# EAGLE design SolderDispenser v1.1 (EAGLE 9.6.2)
CNAME: Solder paste dispenser; DESIGNER: Miroslav Pivovarsky
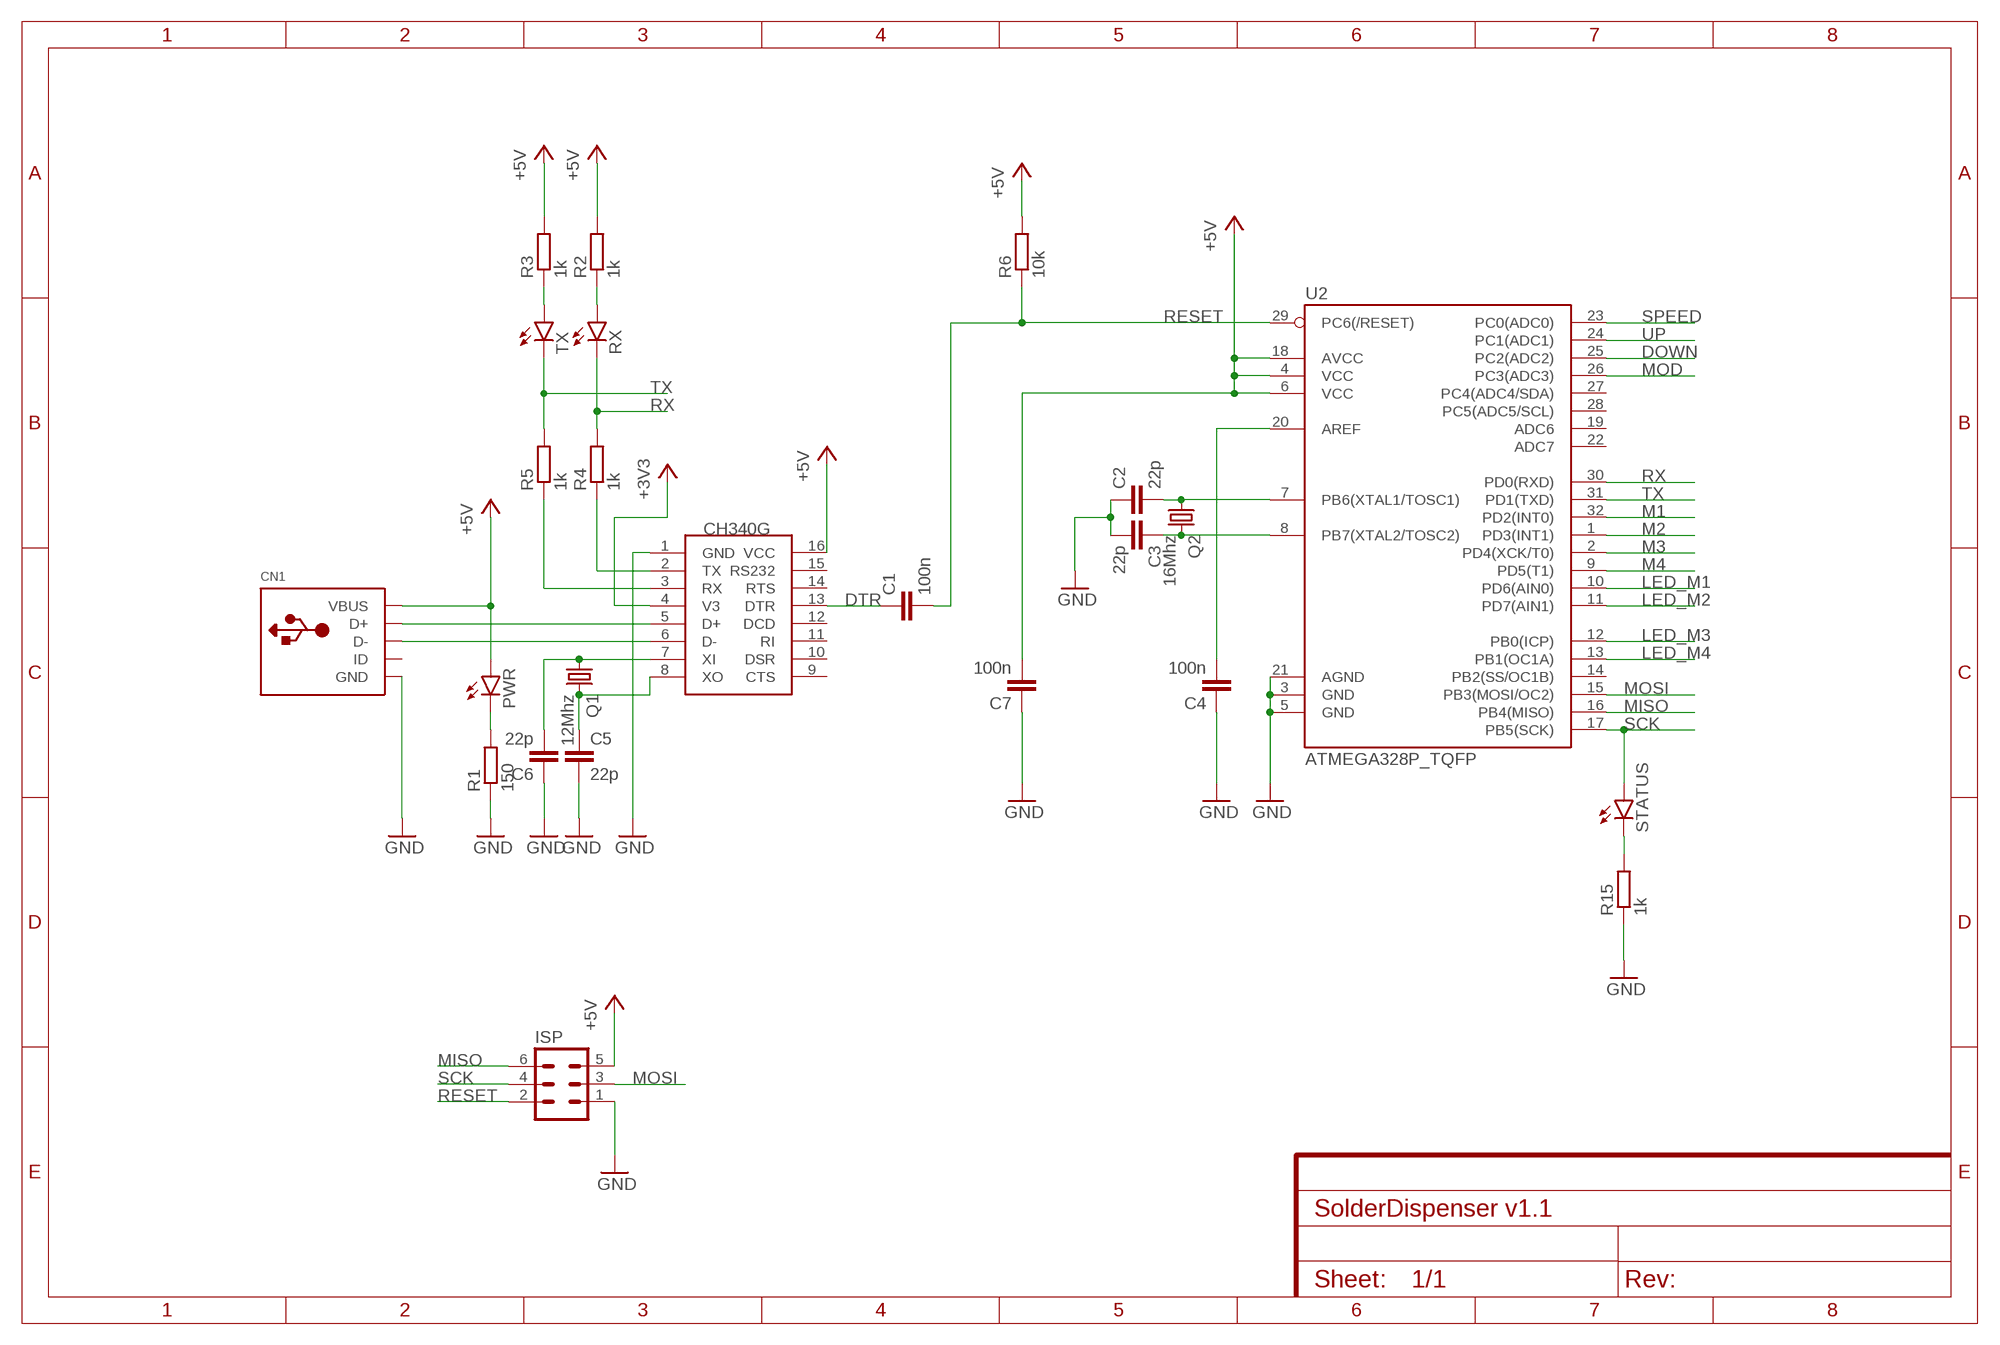
[diagram p0: schematic, sheet 1, part 1 of 2]
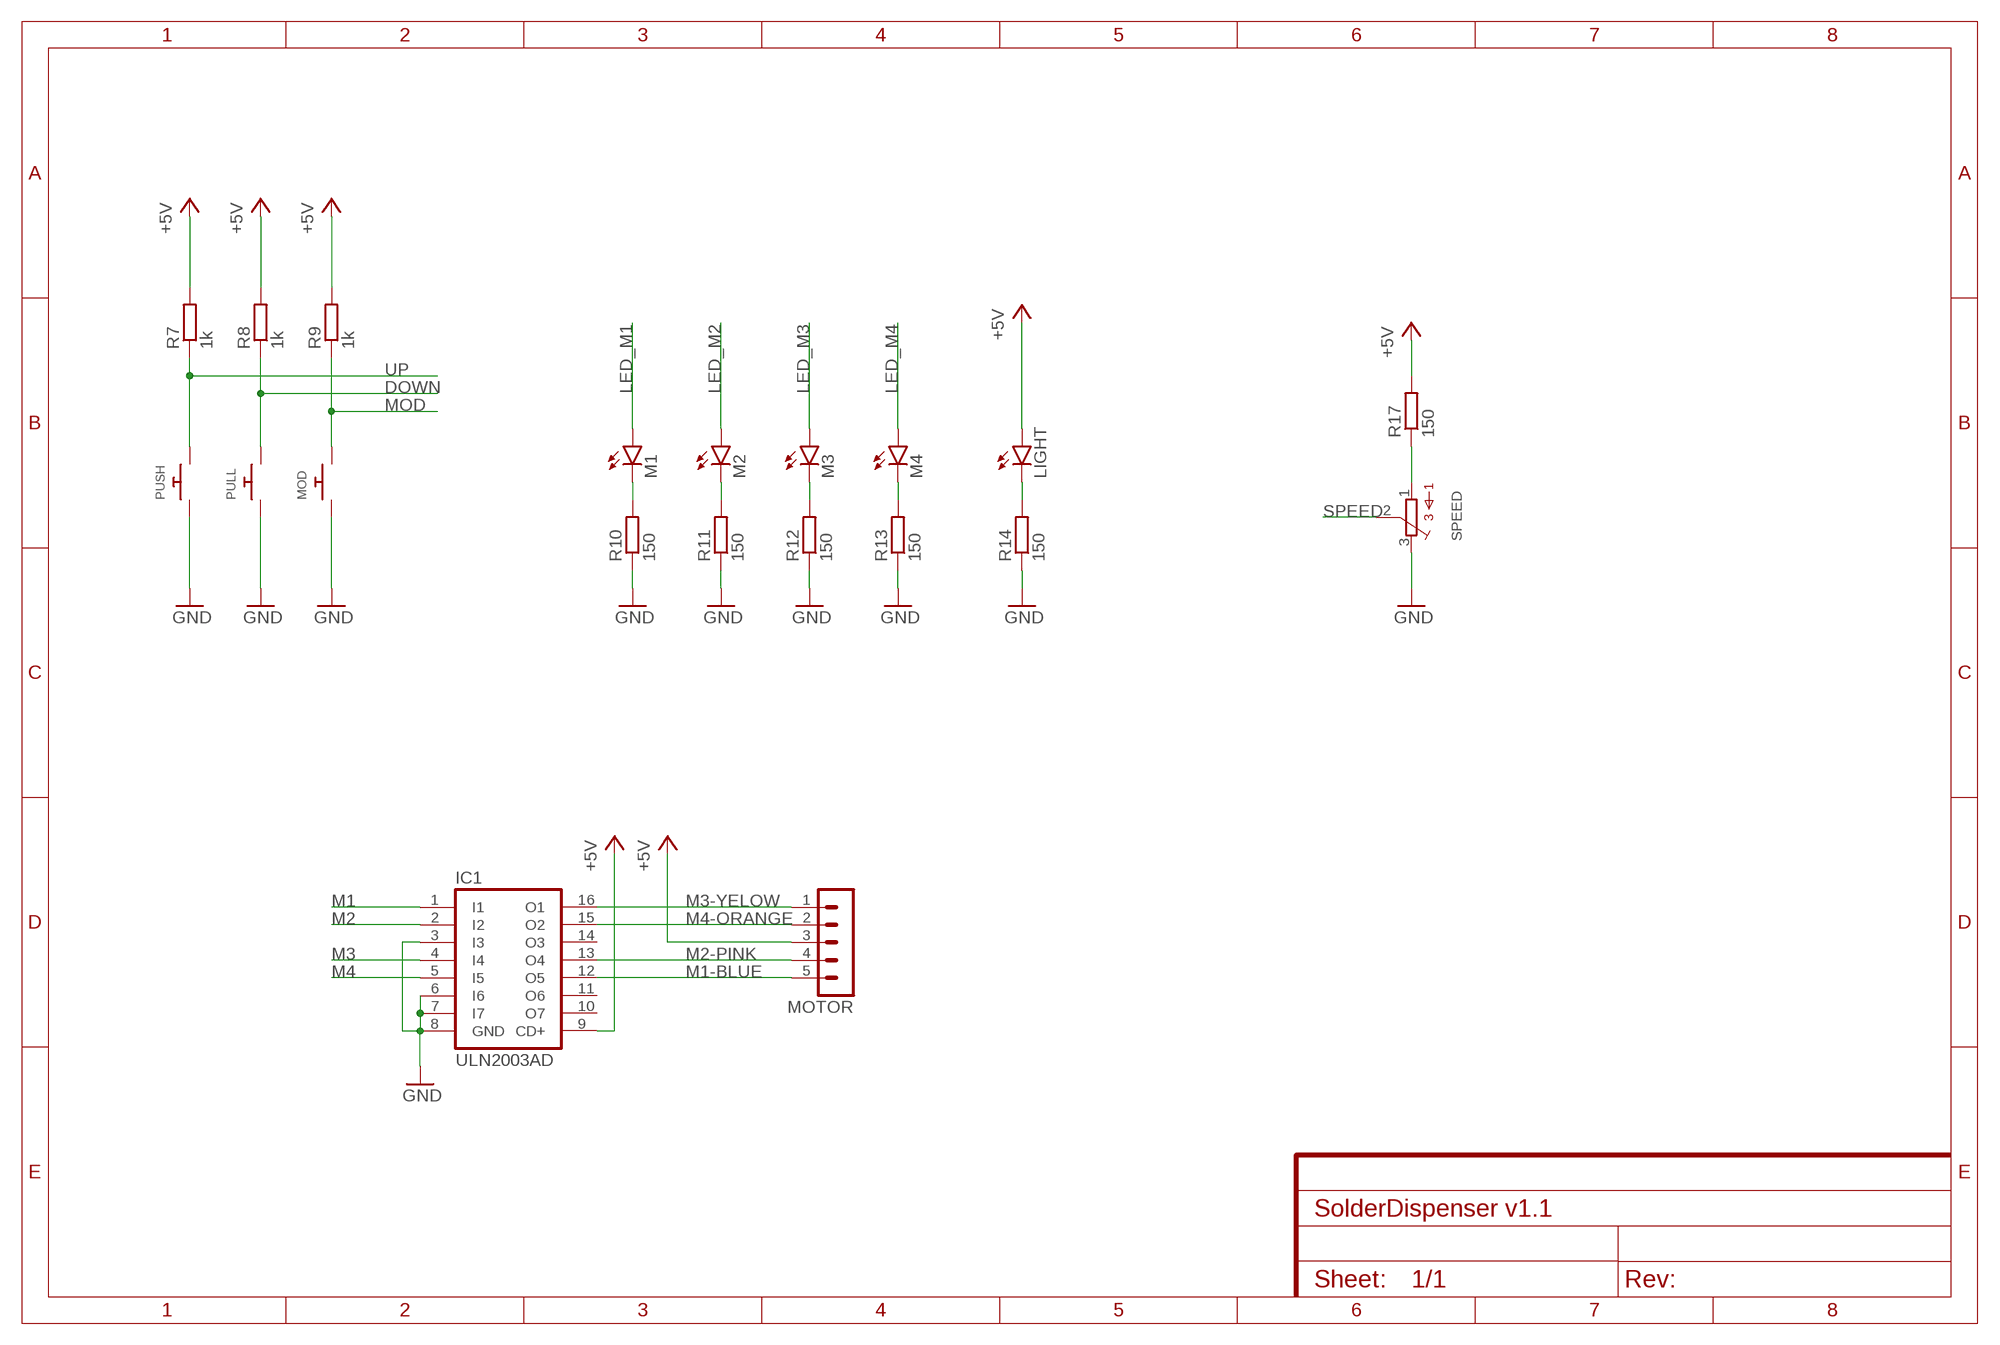
[diagram p1: schematic, sheet 1, part 2 of 2]

## Parts
C1  100n  C-EUC0805  [C0805]
C2  22p  C-EUC0805  [C0805]
C3  22p  C-EUC0805  [C0805]
C4  100n  C-EUC0805  [C0805]
C5  22p  C-EUC0805  [C0805]
C6  22p  C-EUC0805  [C0805]
C7  100n  C-EUC0805  [C0805]
CN1  USBMOLEX  [USB-MINIB-THM-MOLEX]
IC1  ULN2003AD  [SO16]
ISP  MA03-2  [MA03-2]
LIGHT  LED5MM  [LED5MM]
M1  LEDSML0805  [SML0805]
M2  LEDSML0805  [SML0805]
M3  LEDSML0805  [SML0805]
M4  LEDSML0805  [SML0805]
MOD  SWITCH_PUSHBUTTONEVQ-PE  [TACT_PANA-EVQ]
MOTOR  MA05-1  [MA05-1]
PULL  SWITCH_PUSHBUTTONEVQ-PE  [TACT_PANA-EVQ]
PUSH  SWITCH_PUSHBUTTONEVQ-PE  [TACT_PANA-EVQ]
PWR  LEDSML0805  [SML0805]
Q1  12Mhz  CRYSTALHC49UP  [HC49UP]
Q2  16Mhz  CRYSTALHC49UP  [HC49UP]
R1  150  R-EU_R0805  [R0805]
R2  1k  R-EU_R0805  [R0805]
R3  1k  R-EU_R0805  [R0805]
R4  1k  R-EU_R0805  [R0805]
R5  1k  R-EU_R0805  [R0805]
R6  10k  R-EU_R0805  [R0805]
R7  1k  R-EU_R0805  [R0805]
R8  1k  R-EU_R0805  [R0805]
R9  1k  R-EU_R0805  [R0805]
R10  150  R-EU_R0805  [R0805]
R11  150  R-EU_R0805  [R0805]
R12  150  R-EU_R0805  [R0805]
R13  150  R-EU_R0805  [R0805]
R14  150  R-EU_R0805  [R0805]
R15  1k  R-EU_R0805  [R0805]
R17  150  R-EU_R0805  [R0805]
RX  LEDSML0805  [SML0805]
SPEED  3362P  [3362P]
STATUS  LEDSML0805  [SML0805]
TX  LEDSML0805  [SML0805]
U2  ATMEGA328P_TQFP  [TQFP32-08]
U$1  CH340G  [SOIC16]

## Nets
+3V3: U$1.4(V3)
+5V: C7.2 CN1.VBUS IC1.9(CD+) ISP.5 LIGHT.A MOTOR.3 PWR.A R2.2 R3.2 R6.2 R7.2 R8.2 R9.2 R17.2 U2.4(VCC) U2.6(VCC) U2.18(AVCC) U$1.16(VCC)
DOWN: PULL.P$2 R8.1 U2.25(PC2(ADC2))
DTR: C1.1 U$1.13(DTR)
GND: C2.1 C3.2 C4.1 C5.2 C6.1 C7.1 CN1.GND IC1.3(I3) IC1.6(I6) IC1.7(I7) IC1.8(GND) ISP.1 MOD.P$1 PULL.P$1 PUSH.P$1 R1.1 R10.1 R11.1 R12.1 R13.1 R14.1 R15.1 SPEED.3 U2.3(GND) U2.5(GND) U2.21(AGND) U$1.1(GND)
LED_M1: M1.A U2.10(PD6(AIN0))
LED_M2: M2.A U2.11(PD7(AIN1))
LED_M3: M3.A U2.12(PB0(ICP))
LED_M4: M4.A U2.13(PB1(OC1A))
M1: IC1.1(I1) U2.32(PD2(INT0))
M1-BLUE: IC1.12(O5) MOTOR.5
M2: IC1.2(I2) U2.1(PD3(INT1))
M2-PINK: IC1.13(O4) MOTOR.4
M3: IC1.4(I4) U2.2(PD4(XCK/T0))
M3-YELOW: IC1.16(O1) MOTOR.1
M4: IC1.5(I5) U2.9(PD5(T1))
M4-ORANGE: IC1.15(O2) MOTOR.2
MISO: ISP.6 U2.16(PB4(MISO))
MOD: MOD.P$2 R9.1 U2.26(PC3(ADC3))
MOSI: ISP.3 U2.15(PB3(MOSI/OC2))
N$1: CN1.D+ U$1.5(D+)
N$2: PWR.C R1.2
N$3: CN1.D- U$1.6(D-)
N$4: R5.1 U$1.3(RX)
N$5: R4.1 U$1.2(TX)
N$6: C2.2 Q2.1 U2.7(PB6(XTAL1/TOSC1))
N$7: C6.2 Q1.1 U$1.7(XI)
N$8: C5.1 Q1.2 U$1.8(XO)
N$9: R2.1 RX.A
N$10: R3.1 TX.A
N$11: C3.1 Q2.2 U2.8(PB7(XTAL2/TOSC2))
N$12: C4.2 U2.20(AREF)
N$13: M1.C R10.2
N$14: LIGHT.K(C) R14.2
N$15: M2.C R11.2
N$16: R15.2 STATUS.C
N$17: M3.C R12.2
N$19: M4.C R13.2
N$20: R17.1 SPEED.1
RESET: C1.2 ISP.2 R6.1 U2.29(PC6(/RESET))
RX: R4.2 RX.C U2.30(PD0(RXD))
SCK: ISP.4 STATUS.A U2.17(PB5(SCK))
SPEED: SPEED.2 U2.23(PC0(ADC0))
TX: R5.2 TX.C U2.31(PD1(TXD))
UP: PUSH.P$2 R7.1 U2.24(PC1(ADC1))
Unconnected: CN1.ID IC1.10(O7) IC1.11(O6) IC1.14(O3) U2.14(PB2(SS/OC1B)) U2.19(ADC6) U2.22(ADC7) U2.27(PC4(ADC4/SDA)) U2.28(PC5(ADC5/SCL)) U$1.9(CTS) U$1.10(DSR) U$1.11(RI) U$1.12(DCD) U$1.14(RTS) U$1.15(RS232)

## Library data of the parts
C1-C7 = rcl:C-EU: CAPACITOR, European symbol; SPICEPREFIX: C
CN1 = adafruit:USB: USB Connectors USBMINIB - Surface Mount Female Mini-B USB Connector 4UConnector: 06564 By microbuilder.eu Thru-hole RA Female Mini-B USB Connector 4UConnector: 18732 By ladyada.net
IC1 = uln-udn:ULN2003A: DRIVER ARRAY
ISP = con-lstb:MA03-2: PIN HEADER; OC_FARNELL: unknown; OC_NEWARK: unknown
LIGHT M1-M4 PWR RX STATUS TX = led:LED: LED OSRAM: - CHIPLED LG R971, LG N971, LY N971, LG Q971, LY Q971, LO R971, LY R971 LH N974, LH R974 LS Q976, LO Q976, LY Q976 LO Q996 - Hyper CHIPLED LW Q18S LB Q993, LB Q99A, LB R99A - SideLED LS A670, LO A670, LY A670, LG A670, LP A670 LB A673, LV A673, LT A673, LW A673 LH A674 LY A675 LS A676, LA A676, LO A676, LY A676, LW A676 LS A679, LY A679, LG A679 - Hyper Micro SIDELED® LS Y876, LA Y876, LO Y876, LY Y876 LT Y87S - SmartLED LW L88C, LW L88S LB L89C, LB L89S, LG L890 LS L89K, LO L89K, LY L89K LS L896, LA L896, LO L896, LY L896 - TOPLED LS T670, LO T670, LY T670, LG T670, LP T670 LSG T670, LSP T670, LSY T670, LOP T670, LYG T670 LG T671, LOG T671, LSG T671 LB T673, LV T673, LT T673, LW T673 LH T674 LS T676, LA T676, LO T676, LY T676, LB T676, LH T676, LSB T676, LW T676 LB T67C, LV T67C, LT T67C, LS T67K, LO T67K, LY T67K, LW E67C LS E67B, LA E67B, LO E67B, LY E67B, LB E67C, LV E67C, LT E67C LW T67C LS T679, LY T679, LG T679 LS T770, LO T770, LY T770, LG T770, LP T770 LB T773, LV T773, LT T773, LW T773 LH T774 LS E675, LA E675, LY E675, LS T675 LS T776, LA T776, LO T776, LY T776, LB T776 LHGB T686 LT T68C, LB T68C - Hyper Mini TOPLED® LB M676 - Mini TOPLED Santana® LG M470 LS M47K, LO M47K, LY M47K Source: http://www.osram.convergy.de LUXEON: - LUMILED® LXK2-PW12-R00, LXK2-PW12-S00, LXK2-PW14-U00, LXK2-PW14-V00 LXK2-PM12-R00, LXK2-PM12-S00, LXK2-PM14-U00 LXK2-PE12-Q00, LXK2-PE12-R00, LXK2-PE12-S00, LXK2-PE14-T00, LXK2-PE14-U00 LXK2-PB12-K00, LXK2-PB12-L00, LXK2-PB12-M00, LXK2-PB14-N00, LXK2-PB14-P00, LXK2-PB14-Q00 LXK2-PR12-L00, LXK2-PR12-M00, LXK2-PR14-Q00, LXK2-PR14-R00 LXK2-PD12-Q00, LXK2-PD12-R00, LXK2-PD12-S00 LXK2-PH12-R00, LXK2-PH12-S00 LXK2-PL12-P00, LXK2-PL12-Q00, LXK2-PL12-R00 Source: www.luxeon.com KINGBRIGHT: KA-3528ASYC Source: www.kingbright.com
MOD PULL PUSH = adafruit:SWITCH_PUSHBUTTON: Buttons SOFTTOUCHSMD_SJ - Soft touch temporary push button (Super Junk Akihabara) Compatible with SKPMANE010 [Mouser: 688-SKPMAN] C&K_KSS = Digikey: KSS221GLFS
MOTOR = con-lstb:MA05-1: PIN HEADER; OC_FARNELL: unknown; OC_NEWARK: unknown
Q1 Q2 = adafruit:CRYSTAL: CRYSTAL; OC_FARNELL: unknown; OC_NEWARK: unknown
R1-R15 R17 = rcl:R-EU_: RESISTOR, European symbol; SPICEPREFIX: R
SPEED = bourns:3362: 3362 Series 1/4" Square Trimmer
U2 = SparkFun-DigitalIC:ATMEGA328P_TQFP; PROD_ID: IC-09069
U$1 = ch340g:CH340G

## Board
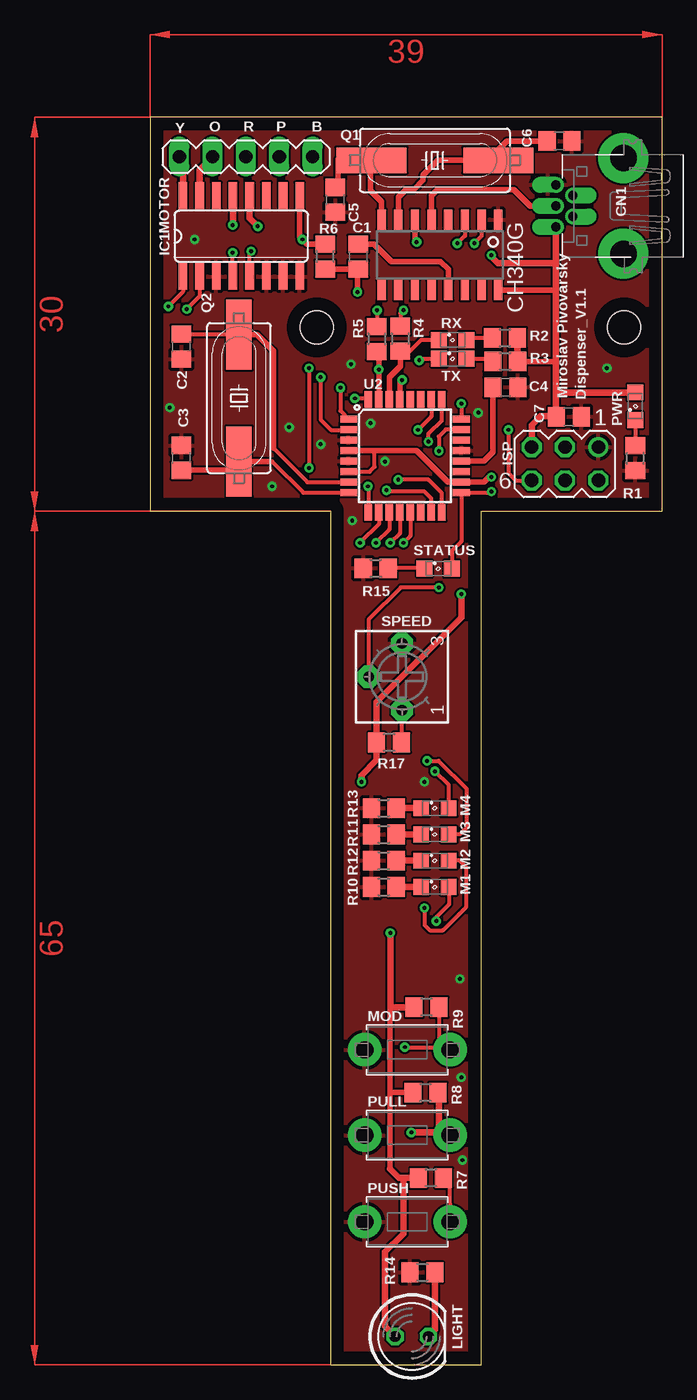
[diagram p2: board, top side]
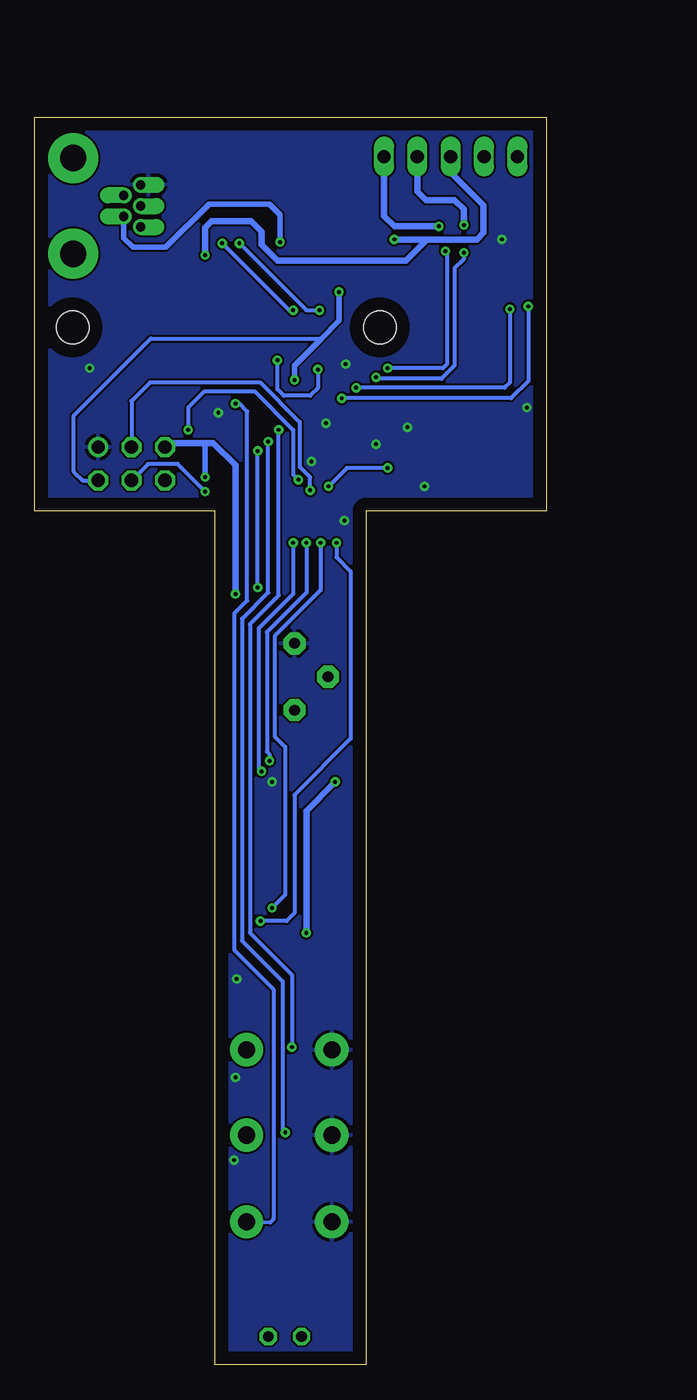
[diagram p3: board, bottom side, seen from below]

Size 39 x 95 mm. Coordinates in mm from the lower left corner, seen from the top.
Outline: 0,65 13.75,65 13.75,0 25.25,0 25.25,65 39,65 39,95 0,95 0,65
Copper layers (1*16): Top 0.035mm / dielectric 1.5mm / Bottom 0.035mm
Design rules "default *": minimum track width 6mil, minimum drill 0.35mm, track to track 6mil, track to pad 6mil, pad to pad 6mil, via to via 6mil, smd to smd 6mil, copper to edge 40mil, drill to drill 6mil, minimum pad ring 10mil, minimum via ring 8mil, stop-mask expansion 4mil, vias tented up to drill 15mil, thermal gap 10mil
Holes 2.5 mm at 12.7,79 36.1,79

### Footprints (pad centres in the part's own frame; a part is rotated, then mirrored left to right if it is on the bottom)
C0805 = smd 1.3 x 1.5: 1 -0.95,0; 2 0.95,0
USB-MINIB-THM-MOLEX = drill 0.7 offset: D+ 0,9.72; D- -0.8,8.42; GND 1.6,9.72; ID 0.8,8.42; VBUS -1.6,9.72 | drill 2 pad 3.81: GND1 -3.65,4.57; GND4 3.65,4.57
SO16 = smd 0.66 x 2.032: 1 -4.445,-3.073; 2 -3.175,-3.073; 3 -1.905,-3.073; 4 -0.635,-3.073; 5 0.635,-3.073; 6 1.905,-3.073; 7 3.175,-3.073; 8 4.445,-3.073; 9 4.445,3.073; 10 3.175,3.073; 11 1.905,3.073; 12 0.635,3.073; 13 -0.635,3.073; 14 -1.905,3.073; 15 -3.175,3.073; 16 -4.445,3.073
MA03-2 = drill 1.016: 1 -2.54,-1.27 | drill 1.016 octagon: 2 -2.54,1.27; 3 0,-1.27; 4 0,1.27; 5 2.54,-1.27; 6 2.54,1.27
LED5MM = drill 0.813 octagon: A -1.27,0; K 1.27,0
SML0805 = smd 1.2 x 1.2: A 1.05,0; C -1.05,0
TACT_PANA-EVQ = drill 1.3 pad 2.54: P$1 -3.25,0; P$2 3.25,0
MA05-1 = drill 1.016 long: 1 -5.08,0; 2 -2.54,0; 3 0,0; 4 2.54,0; 5 5.08,0
HC49UP = smd 5.334 x 1.93: 1 -4.826,0; 2 4.826,0
R0805 = smd 1.3 x 1.5: 1 -0.95,0; 2 0.95,0
3362P = drill 0.813 pad 1.676 octagon: 1 -2.54,0; 2 0,2.54; 3 2.54,0
TQFP32-08 = smd 1.27 x 0.559: 1 -4.293,2.8; 2 -4.293,2; 3 -4.293,1.2; 4 -4.293,0.4; 5 -4.293,-0.4; 6 -4.293,-1.2; 7 -4.293,-2; 8 -4.293,-2.8; 17 4.293,-2.8; 18 4.293,-2; 19 4.293,-1.2; 20 4.293,-0.4; 21 4.293,0.4; 22 4.293,1.2; 23 4.293,2; 24 4.293,2.8 | smd 0.559 x 1.27: 9 -2.8,-4.293; 10 -2,-4.293; 11 -1.2,-4.293; 12 -0.4,-4.293; 13 0.4,-4.293; 14 1.2,-4.293; 15 2,-4.293; 16 2.8,-4.293; 25 2.8,4.293; 26 2,4.293; 27 1.2,4.293; 28 0.4,4.293; 29 -0.4,4.293; 30 -1.2,4.293; 31 -2,4.293; 32 -2.8,4.293
SOIC16 = smd 0.635 x 1.524: 1 -4.445,-2.695; 2 -3.175,-2.695; 3 -1.905,-2.695; 4 -0.635,-2.695; 5 0.635,-2.695; 6 1.905,-2.695; 7 3.175,-2.695; 8 4.445,-2.695; 9 4.445,2.695; 10 3.175,2.695; 11 1.905,2.695; 12 0.635,2.695; 13 -0.635,2.695; 14 -1.905,2.695; 15 -3.175,2.695; 16 -4.445,2.695

### Placement (x,y rotation side)
C1  15.86,84.4 270 top
C2  2.39,77.55 90 top
C3  2.39,69.07 90 top
C4  27.06,74.44 180 top
C5  14.11,88.71 270 top
C6  31.19,93.19 180 top
C7  31.9,72.2 180 top
CN1  40.63,88.25 90 top
IC1  6.95,85.95 0 top
ISP  31.61,68.62 180 top
LIGHT  19.93,2.17 0 top
M1  21.7,36.4 0 top
M2  21.7,38.4 0 top
M3  21.7,40.4 0 top
M4  21.7,42.4 0 top
MOD  19.6,24 0 top
MOTOR  7.3,92 0 top
PULL  19.6,17.5 0 top
PUSH  19.6,10.9 0 top
PWR  36.96,73 90 top
Q1  21.69,91.72 180 top
Q2  6.77,73.62 270 top
R1  36.96,69.04 90 top
R2  27.03,78.21 0 top
R3  27.05,76.41 0 top
R4  19.06,78.14 270 top
R5  17.26,78.12 270 top
R6  13.34,84.4 90 top
R7  21.4,14.24 180 top
R8  20.98,20.74 180 top
R9  21.06,27.24 180 top
R10  17.8,36.4 0 top
R11  17.8,38.4 0 top
R12  17.8,40.4 0 top
R13  17.8,42.4 0 top
R14  20.74,7.06 0 top
R15  17.19,60.66 0 top
R17  18.21,47.39 180 top
RX  23.05,78.04 0 top
SPEED  19.19,52.4 90 top
STATUS  21.95,60.64 0 top
TX  23.05,76.62 0 top
U2  19.42,69.22 0 top
U$1  22.08,84.52 180 top

### Tracks (layer width: path | path; a pad name or v marks a point on that pad's centre or on a via)
+5V  (via drill 0.3)
  Top 0.305: U2.6 16.72,68.02 17.1,68.4 17.1,69.62
  Top 0.406: 18.26,14.94 18.26,20.74 | 18.26,20.74 18.26,27.2 18.3,27.2 | R8.2 18.26,20.74 | U2.4 17.1,69.62 20.28,69.62 22.68,67.22 U2.18 25.42,67.22 25.8,67.6 v26,67.6 | IC1.9 11.39,85.91 v11.6,85.7 11.95,85.35 R6.2 | R3.2 30.9,76.41 30.91,76.4 | U$1.16 30.84,81.83 30.91,81.9
  Top 0.508: R7.2 19.3,14.24 | 19.3,14.24 18.96,14.24 18.26,14.94 | R9.2 18.34,27.24 18.3,27.2 v18.3,32.9 | v16.1,44.4 16.1,44.9 17.26,46.06 R17.2 17.26,50.46 23.7,56.9 v23.7,58.7 | LIGHT.A 17.9,2.93 17.9,8.6 19.3,10 19.3,14.24 | CN1.VBUS 30.91,83.9 | 30.91,83.9 30.91,81.9 30.91,76.4 30.91,73.9 | 30.91,83.9 26.5,83.9 26,84.4 v26,84.5 | PWR.A 31.06,74.05 30.91,73.9 | R2.2 27.98,76.43 R3.2 | 30.91,73.9 30.91,72.24 | 30.91,72.24 C7.2 | ISP.5 29.07,71.57 29.74,72.24 30.91,72.24
  Bottom 0.406: ISP.5 28.76,70.2 | v26,67.6 26,70.2
  Bottom 0.508: v18.3,32.9 18.3,42.2 v16.1,44.4 | v23.7,58.7 23.7,68.5 25.4,70.2 26,70.2 28.76,70.2 | v26,84.5 26,86.6 25.5,87.1 22.5,87.1 21.7,86.3 21.7,85.3 20.5,84.1 10.7,84.1 9.1,85.7 | 9.1,85.7 5.3,85.7 4.8,86.2 4.8,88.3 7.3,90.8 MOTOR.3 | v11.6,85.7 9.1,85.7
DOWN  (via drill 0.3)
  Top 0.305: v21.2,70.3 21.2,70.9 22.22,71.92 U2.25
  Top 0.508: v19.9,17.7 22,17.7 | 22,17.7 22.65,17.7 PULL.P$2 | R8.1 22,20.67 22,17.7
  Bottom 0.305: v21.2,70.3 21.2,58.8 23.2,56.8 23.2,32.3 20.1,29.2 20.1,17.9 v19.9,17.7
DTR
  Top 0.406: C1.1 17.05,85.35 18.38,84.03 22.11,84.03 22.71,83.42 U$1.13
GND  (via drill 0.3)
  other vias: 20.9,44.4 23.6,29.4 23.7,21.9 23.8,15.6 10.6,71.4 3.4,85.7 25,72.5 34.8,75.9 15.3,76.2 13,70.1 1.5,72.9 16.8,71.7 15.4,64.3 9.3,66.9 17.9,68.8
  pour Top: 13.7,0 13.7,65 0,65 0,95.2 39,95.2 39,65 25.3,65 25.3,0
  pour Bottom: 13.7,0 13.7,65 0,65 0,95.1 39,95.1 39,65 25.3,65 25.3,0
LED_M1  (via drill 0.3)
  Top 0.305: U2.10 17.42,64.02 v16,62.6 | v21.8,33.8 21.8,34.1 22.8,35.1 22.8,36.35 M1.A
  Bottom 0.305: v16,62.6 16,61.5 14.92,60.42 14.92,47.68 19.2,43.4 19.2,34.4 19.8,33.8 v21.8,33.8
LED_M2  (via drill 0.3)
  Top 0.305: U2.11 18.22,63.62 v17.2,62.6 | v20.9,34.8 20.9,33.5 21.3,33.1 22.3,33.1 24.08,34.88 24.08,37.9 23.58,38.4 M2.A
  Bottom 0.305: v17.2,62.6 17.2,59 20.7,55.5 20.7,47.87 19.9,47.07 19.9,35.8 v20.9,34.8
LED_M3  (via drill 0.3)
  Top 0.305: U2.12 19.02,63.32 v18.3,62.6 | v21.1,46 21.98,46 24.08,43.9 24.08,40.88 23.6,40.4 M3.A
  Bottom 0.305: v18.3,62.6 18.3,58.8 21.3,55.8 21.3,46.7 21.1,46.5 v21.1,46
LED_M4  (via drill 0.3)
  Top 0.305: U2.13 19.82,63.12 v19.3,62.6 | M4.A 22.75,44.15 v21.7,45.2
  Bottom 0.305: v19.3,62.6 19.3,58.7 21.9,56.1 21.9,45.4 v21.7,45.2
M1  (via drill 0.3)
  Top 0.305: IC1.1 2.5,81.71 v1.39,80.6 | v15.6,73.6 16.53,73.6 U2.32
  Bottom 0.305: v1.39,80.6 1.39,74.91 2.7,73.6 v15.6,73.6
M1-BLUE  (via drill 0.3)
  Top 0.508: IC1.12 7.59,87.31 v8.2,86.7
  Bottom 0.508: v8.2,86.7 11.6,86.7 12.38,87.48 MOTOR.5
M2  (via drill 0.3)
  Top 0.305: IC1.2 3.78,81.38 v2.8,80.4 | v14.5,74.4 14.5,72.65 U2.1
  Bottom 0.305: v2.8,80.4 2.8,74.8 3.2,74.4 v14.5,74.4
M2-PINK  (via drill 0.3)
  Top 0.508: IC1.13 6.31,86.81 v6.3,86.8
  Bottom 0.508: v6.3,86.8 6.3,88 7,88.7 9.2,88.7 9.84,89.34 MOTOR.4
M3  (via drill 0.3)
  Top 0.305: IC1.4 6.3,82.89 v6.3,84.7 | v13,75.2 13,72 13.8,71.2 15.11,71.2 U2.2
  Bottom 0.305: v6.3,84.7 6.3,84.2 7,83.5 7,76.1 8,75.1 12.9,75.1 v13,75.2
M3-YELOW
  Top 0.508: MOTOR.1 2.5,91.72 IC1.16
M4  (via drill 0.3)
  Top 0.305: IC1.5 7.59,84.69 v7.7,84.8 | v12.1,75.9 v12.1,68.3 | v16.6,66.9 16.62,66.88 U2.9
  Bottom 0.305: v7.7,84.8 7.6,84.7 7.6,76.2 7.9,75.9 v12.1,75.9 | v12.1,68.3 15.2,68.3 v16.6,66.9
M4-ORANGE
  Top 0.508: IC1.15 3.78,91.02 MOTOR.2
MISO  (via drill 0.3)
  Top 0.305: U2.16 22.22,66.38 21.2,67.4 v18.9,67.4 | v27.3,71.2 27.3,67.9 27.85,67.35 ISP.6
  Bottom 0.305: v18.9,67.4 19.3,67.8 19.3,71.2 22.2,74.1 26.1,74.1 27.3,72.9 v27.3,71.2
MOD  (via drill 0.3)
  Top 0.305: v19.4,24.2 22,24.2 | 22,24.2 22.7,24.2 MOD.P$2 | R9.1 22.01,24.21 22,24.2 | U2.26 21.42,72.22 v20.4,71.2
  Bottom 0.305: v20.4,71.2 20.4,58.6 22.6,56.4 22.6,32.9 19.4,29.7 v19.4,24.2
MOSI  (via drill 0.3)
  Top 0.305: U2.15 21.42,65.98 20.9,66.5 18.1,66.5 v18,66.6
  Bottom 0.305: v18,66.6 18,67.6 18.8,68.4 18.8,71.8 21.8,74.8 30.2,74.8 31.61,73.39 ISP.3
N$1
  Top 0.406: CN1.D+ 28.95,88.25 27.7,89.5 21.9,89.5 21.45,89.05 U$1.5
N$2
  Top 0.305: PWR.C R1.2
N$3  (via drill 0.3)
  Top 0.406: v20.3,85.5 20.18,85.62 U$1.6
  Bottom 0.406: CN1.D- 32.21,85.81 31.5,85.1 29,85.1 25.7,88.4 21.1,88.4 20.3,87.6 v20.3,85.5
N$4  (via drill 0.3)
  Top 0.305: U$1.3 23.98,85.98 v23.4,85.4 | v17.3,80.3 17.3,79.11 R5.1
  Bottom 0.305: v23.4,85.4 18.3,80.3 v17.3,80.3
N$5  (via drill 0.3)
  Top 0.305: U$1.2 25.25,85.95 v24.7,85.4 | v19.3,80.3 19.06,80.06 R4.1
  Bottom 0.305: v24.7,85.4 19.6,80.3 v19.3,80.3
N$6
  Top 0.305: C2.2 6.72,78.5 Q2.1 | U2.7 11.98,67.22 9.4,69.8
  Top 0.406: Q2.1 8.15,78.45 9.4,77.2 9.4,69.8
N$7
  Top 0.406: U$1.7 18.91,88.91 19.5,89.5 20.1,89.5 20.8,90.2 20.8,90.6 21.92,91.72 Q1.1 26.52,92.52 27.19,93.19 C6.2
N$8
  Top 0.406: U$1.8 17.64,88.56 16.8,89.4 16.8,91.66 | 16.8,91.66 Q1.2 | C5.1 14.3,89.85 14.3,91.8 16.66,91.8 16.8,91.66
N$9
  Top 0.305: RX.A 24.27,78.21 R2.1
N$10
  Top 0.305: TX.A 25.89,76.62 R3.1
N$11
  Top 0.305: 8.99,68.79 9.31,68.79 11.68,66.42 U2.8
  Top 0.406: 8.99,68.79 Q2.2 6.77,68.12 C3.1
N$12
  Top 0.406: U2.20 25.42,68.82 26.11,69.51 C4.2
N$13
  Top 0.508: R10.2 M1.C
N$14
  Top 0.508: R14.2 21.69,2.66 LIGHT.K
N$15
  Top 0.508: R11.2 M2.C
N$16
  Top 0.305: STATUS.C 20.88,60.66 R15.2
N$17
  Top 0.508: R12.2 M3.C
N$19
  Top 0.508: R13.2 M4.C
N$20
  Top 0.305: SPEED.1 19.16,49.83 R17.1
RESET  (via drill 0.3)
  Top 0.406: R6.1 C1.2 15.8,83.39 v15.8,81.7 | U2.29 19.02,74.82 v19.2,75
  Bottom 0.305: ISP.2 35.35,67.35 36,68 36,72.3 30.15,78.15 17.15,78.15
  Bottom 0.406: v19.2,75 19.2,76.1 17.15,78.15 15.8,79.5 v15.8,81.7
RX
  Top 0.305: RX.C 20.64,78.04 19.79,77.19 R4.2
  Top 0.406: U2.30 18.22,75.22 19.06,76.06 R4.2
SCK  (via drill 0.3)
  Top 0.305: STATUS.A 23,62 23.71,62.71 U2.17 25.92,66.42 v26,66.5
  Bottom 0.305: v26,66.5 28.1,68.6 30.36,68.6 ISP.4
SPEED  (via drill 0.3)
  Top 0.305: v22,59.2 19.1,59.2 16.65,56.75 SPEED.2 | U2.23 22.52,71.22 22,70.7 v22,69.6
  Bottom 0.305: v22,59.2 v22,69.6
TX  (via drill 0.3)
  Top 0.305: v20.5,76.5 20.62,76.62 TX.C
  Top 0.406: U2.31 v17.42,75.8 17.42,77.01 R5.2
  Bottom 0.305: v17.42,75.8 17.42,74.38 18,73.8 20,73.8 20.5,74.3 v20.5,76.5
UP  (via drill 0.3)
  Top 0.305: R7.1 22.81,13.78 PUSH.P$2 | v23.7,73.2 23.71,73.19 U2.24
  Bottom 0.305: PUSH.P$2 21.06,10.84 20.8,11.1 20.8,28.6 23.8,31.6 23.8,57.2 22.8,58.2 22.8,72.6 23.4,73.2 v23.7,73.2
(copper drawn outside any net)
  shapes: Top area x3

### Text on the board
tNames: Y | O | R | P | B | Miroslav Pivovarsky | Dispenser_V1.1